# Altium schematic sheet fpga-bank2.SchDoc: CS - FPGA - Bank 2
size Letter; CheckedBy: J. Brinton; CompanyName: Signal Laboratories, Inc.; DrawnBy: J. Brinton; Engineer: J. Brinton; Address1: 3479 Edison Way; Address2: Menlo Park CA 94025; Address3: +1 (877) 778-8435; Address4: siglabs.com; Revision: 3; SheetNumber: 7; SheetTotal: 47
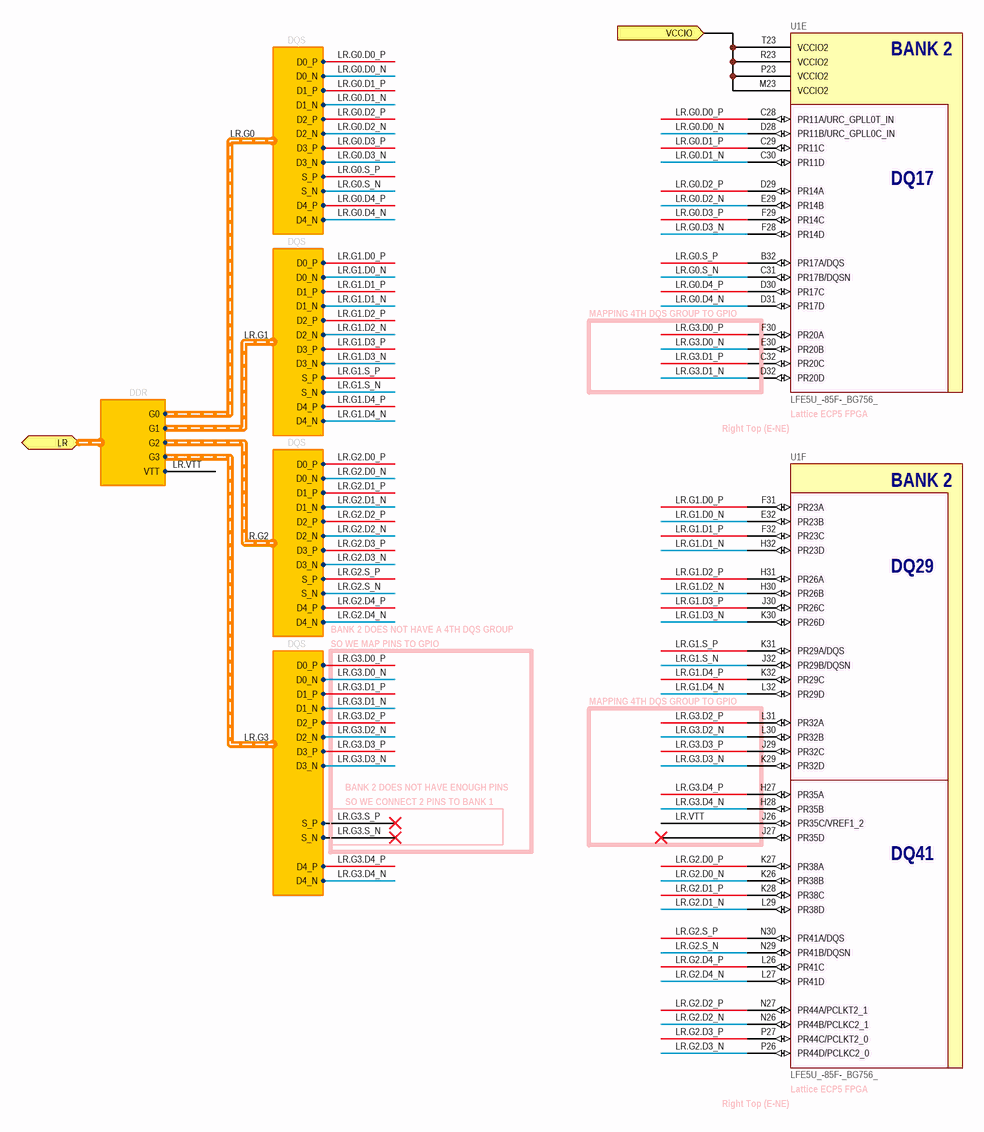
[diagram p0: fpga-bank2.SchDoc]

## Parts
U1  LFE5U_-85F-_BG756_  [caBGA756]  (parts E,F of 19)

## Ports
LR (harness DDR), VCCIO (in)

## Harnesses
DQS: D0_P, D0_N, D1_P, D1_N, D2_P, D2_N, D3_P, D3_N, D4_P, D4_N, S_P, S_N
DDR: G0, G1, G2, G3, VTT

## Nets
LR.G0.D0_N: U1.D28(PR11B/URC_GPLL0C_IN) ; harness DQS.D0_N
LR.G0.D0_P: U1.C28(PR11A/URC_GPLL0T_IN) ; harness DQS.D0_P
LR.G0.D1_N: U1.C30(PR11D) ; harness DQS.D1_N
LR.G0.D1_P: U1.C29(PR11C) ; harness DQS.D1_P
LR.G0.D2_N: U1.E29(PR14B) ; harness DQS.D2_N
LR.G0.D2_P: U1.D29(PR14A) ; harness DQS.D2_P
LR.G0.D3_N: U1.F28(PR14D) ; harness DQS.D3_N
LR.G0.D3_P: U1.F29(PR14C) ; harness DQS.D3_P
LR.G0.D4_N: U1.D31(PR17D) ; harness DQS.D4_N
LR.G0.D4_P: U1.D30(PR17C) ; harness DQS.D4_P
LR.G0.S_N: U1.C31(PR17B/DQSN) ; harness DQS.S_N
LR.G0.S_P: U1.B32(PR17A/DQS) ; harness DQS.S_P
LR.G1.D0_N: U1.E32(PR23B) ; harness DQS.D0_N
LR.G1.D0_P: U1.F31(PR23A) ; harness DQS.D0_P
LR.G1.D1_N: U1.H32(PR23D) ; harness DQS.D1_N
LR.G1.D1_P: U1.F32(PR23C) ; harness DQS.D1_P
LR.G1.D2_N: U1.H30(PR26B) ; harness DQS.D2_N
LR.G1.D2_P: U1.H31(PR26A) ; harness DQS.D2_P
LR.G1.D3_N: U1.K30(PR26D) ; harness DQS.D3_N
LR.G1.D3_P: U1.J30(PR26C) ; harness DQS.D3_P
LR.G1.D4_N: U1.L32(PR29D) ; harness DQS.D4_N
LR.G1.D4_P: U1.K32(PR29C) ; harness DQS.D4_P
LR.G1.S_N: U1.J32(PR29B/DQSN) ; harness DQS.S_N
LR.G1.S_P: U1.K31(PR29A/DQS) ; harness DQS.S_P
LR.G2.D0_N: U1.K26(PR38B) ; harness DQS.D0_N
LR.G2.D0_P: U1.K27(PR38A) ; harness DQS.D0_P
LR.G2.D1_N: U1.L29(PR38D) ; harness DQS.D1_N
LR.G2.D1_P: U1.K28(PR38C) ; harness DQS.D1_P
LR.G2.D2_N: U1.N26(PR44B/PCLKC2_1) ; harness DQS.D2_N
LR.G2.D2_P: U1.N27(PR44A/PCLKT2_1) ; harness DQS.D2_P
LR.G2.D3_N: U1.P26(PR44D/PCLKC2_0) ; harness DQS.D3_N
LR.G2.D3_P: U1.P27(PR44C/PCLKT2_0) ; harness DQS.D3_P
LR.G2.D4_N: U1.L27(PR41D) ; harness DQS.D4_N
LR.G2.D4_P: U1.L26(PR41C) ; harness DQS.D4_P
LR.G2.S_N: U1.N29(PR41B/DQSN) ; harness DQS.S_N
LR.G2.S_P: U1.N30(PR41A/DQS) ; harness DQS.S_P
LR.G3.D0_N: U1.E30(PR20B) ; harness DQS.D0_N
LR.G3.D0_P: U1.F30(PR20A) ; harness DQS.D0_P
LR.G3.D1_N: U1.D32(PR20D) ; harness DQS.D1_N
LR.G3.D1_P: U1.C32(PR20C) ; harness DQS.D1_P
LR.G3.D2_N: U1.L30(PR32B) ; harness DQS.D2_N
LR.G3.D2_P: U1.L31(PR32A) ; harness DQS.D2_P
LR.G3.D3_N: U1.K29(PR32D) ; harness DQS.D3_N
LR.G3.D3_P: U1.J29(PR32C) ; harness DQS.D3_P
LR.G3.D4_N: U1.H28(PR35B) ; harness DQS.D4_N
LR.G3.D4_P: U1.H27(PR35A) ; harness DQS.D4_P
LR.G3.S_N: harness DQS.S_N
LR.G3.S_P: harness DQS.S_P
LR.VTT: U1.J26(PR35C/VREF1_2) ; port LR.VTT
VCCIO: U1.M23(VCCIO2) U1.P23(VCCIO2) U1.R23(VCCIO2) U1.T23(VCCIO2) ; port VCCIO

Not connected (* = marked no-connect by the designer): U1 J27(PR35D)*

## Notes on the sheet
- (near U1) MAPPING 4TH DQS GROUP TO GPIO
- (near U1) Right Top (E-NE)
- (near U1) Lattice ECP5 FPGA
- BANK 2 DOES NOT HAVE A 4TH DQS GROUP
- SO WE MAP PINS TO GPIO
- BANK 2 DOES NOT HAVE ENOUGH PINS
- SO WE CONNECT 2 PINS TO BANK 1
- Title
- Engineer
- Revision
- Drawn By
- Checked By
- Date
- Sheet
- of
- (in symbol LFE5U_-85F-_BG756_, part E) BANK 2; DQ17
- (in symbol LFE5U_-85F-_BG756_, part F) BANK 2; DQ29; DQ41

## Library data of the parts
U1 = LFE5U_-85F-_BG756_: ECP5 FPGA, 85k LUT, 756-caBGA; Manufacturer: Lattice Semiconductor; Manufacturer P/N: LFE5U_-85F-_BG756_